# EAGLE design moduleDHT22 (EAGLE 6.5.0)
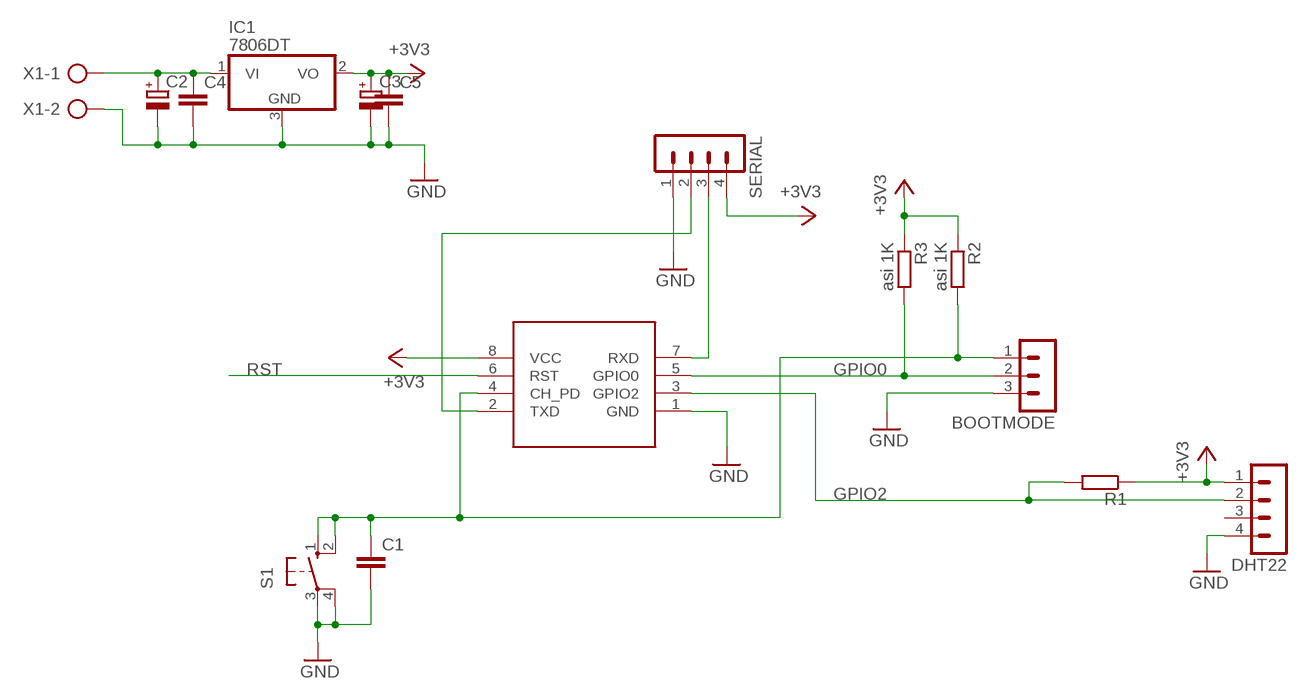
[diagram p0: schematic, sheet 1]

## Parts
BOOTMODE  MA03-1  [MA03-1]
C1  C-EUC0603  [C0603]
C2  CPOL-EU153CLV-0505  [153CLV-0505]
C3  CPOL-EU153CLV-0505  [153CLV-0505]
C4  C-EUC0603  [C0603]
C5  C-EUC0603  [C0603]
DHT22  MA04-1  [MA04-1]
IC1  7806DT  [TO252]
R1  R-EU_R0603  [R0603]
R2  asi 1K  R-EU_R0603  [R0603]
R3  asi 1K  R-EU_R0603  [R0603]
S1  10-XX  [B3F-10XX]
SERIAL  MA04-1  [MA04-1]
U$1  ESP8266-01  [ESP8266-01]
X1  AK300/2  [AK300/2]

## Nets
+3V3: C3.+ C5.1 DHT22.1 IC1.2(VO) R1.1 R2.1 R3.1 SERIAL.4 U$1.8(VCC)
GND: BOOTMODE.3 C1.2 C2.- C3.- C4.2 C5.2 DHT22.4 IC1.3(GND) S1.3(P) S1.4(P1) SERIAL.1 U$1.1(GND) X1.2
GPIO0: BOOTMODE.2 R3.2 U$1.5(GPIO0)
GPIO2: DHT22.2 R1.2 U$1.3(GPIO2)
N$1: C2.+ C4.1 IC1.1(VI) X1.1
N$2: SERIAL.2 U$1.2(TXD)
N$3: SERIAL.3 U$1.7(RXD)
N$5: BOOTMODE.1 C1.1 R2.2 S1.1(S) S1.2(S1) U$1.4(CH_PD)
RST: U$1.6(RST)
Unconnected: DHT22.3

## Library data of the parts
BOOTMODE = con-lstb:MA03-1: PIN HEADER; OC_FARNELL: unknown; OC_NEWARK: unknown
C1 C4 C5 = rcl:C-EU: CAPACITOR, European symbol
C2 C3 = rcl:CPOL-EU: POLARIZED CAPACITOR, European symbol
DHT22 SERIAL = con-lstb:MA04-1: PIN HEADER; OC_FARNELL: unknown; OC_NEWARK: unknown
IC1 = linear:78*: Positive VOLTAGE REGULATOR Source: http://cache.national.com/ds/LM/LM78L05.pdf http://www.fairchildsemi.com/ds/LM/LM7805.pdf
R1-R3 = rcl:R-EU_: RESISTOR, European symbol
S1 = switch-omron:10-XX: OMRON SWITCH; MPN: B3F-1000; OC_FARNELL: 176432; OC_NEWARK: 36M3542
U$1 = ESP8266:ESP8266-01
X1 = con-ptr500:AK300/2: CONNECTOR; OC_FARNELL: unknown; OC_NEWARK: unknown

## Board
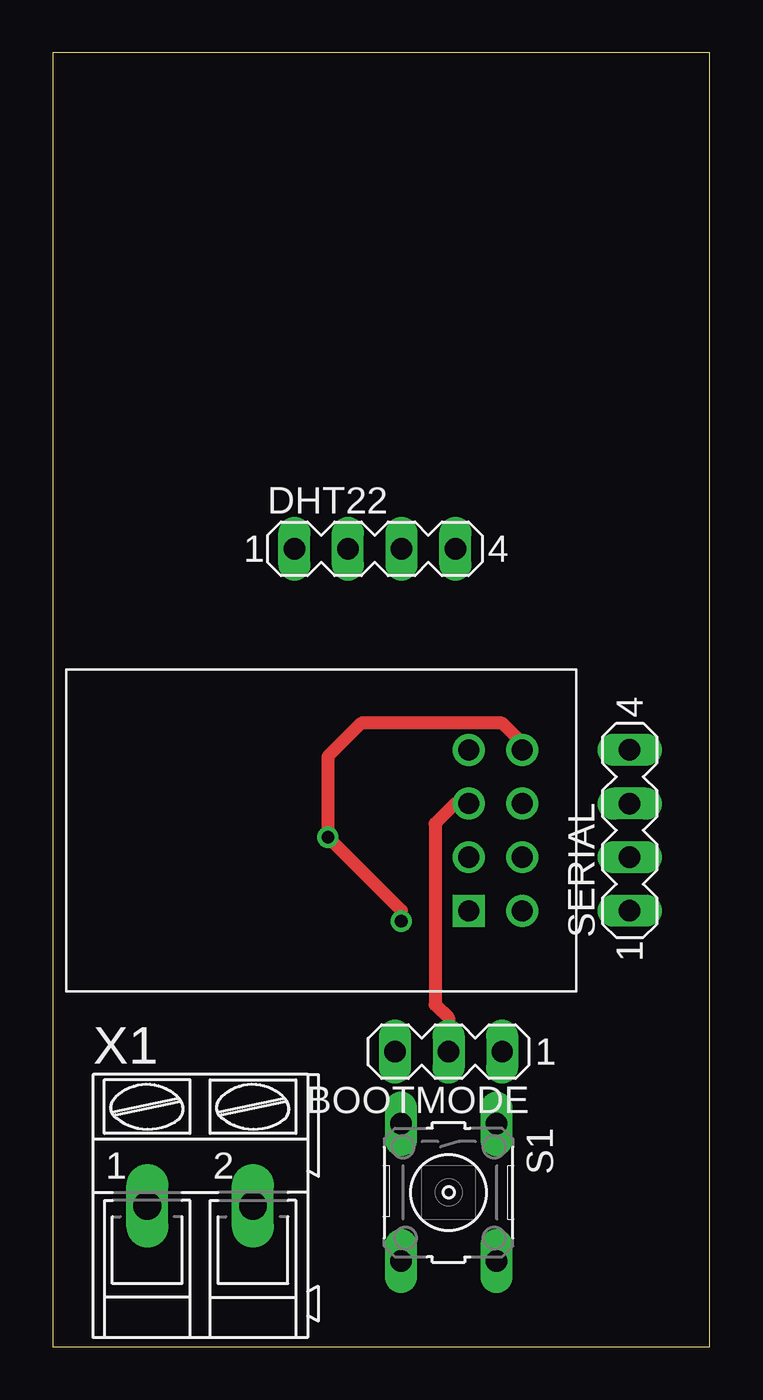
[diagram p1: board, top side]
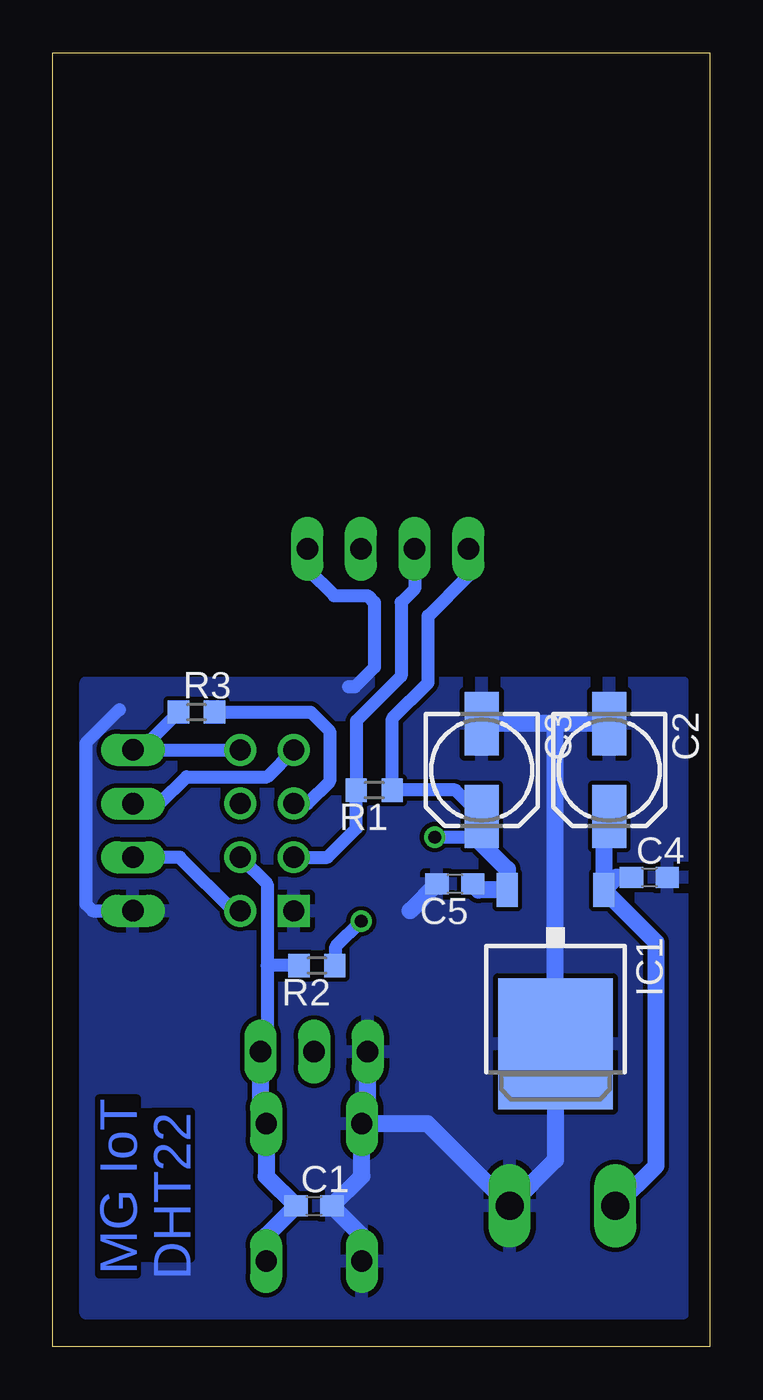
[diagram p2: board, bottom side, seen from below]

Size 31.09 x 61.27 mm. Coordinates in mm from the lower left corner, seen from the top.
Outline: 0,0 31.09,0 31.09,61.27 0,61.27 0,0
Copper layers (1*16): Top 0.035mm / dielectric 1.5mm / Bottom 0.035mm
Design rules "default": minimum track width 10mil, minimum drill 24mil, track to track 8mil, track to pad 8mil, pad to pad 8mil, via to via 8mil, smd to smd 8mil, copper to edge 40mil, drill to drill 8mil, minimum pad ring 10mil, minimum via ring 8mil, stop-mask expansion 4mil, vias tented up to drill 0mil, thermal gap 10mil

### Footprints (pad centres in the part's own frame; a part is rotated, then mirrored left to right if it is on the bottom)
MA03-1 = drill 1.016 long: 1 -2.54,0; 2 0,0; 3 2.54,0
C0603 = smd 1.1 x 1: 1 -0.85,0; 2 0.85,0
153CLV-0505 = smd 3 x 1.6: + 2.2,0; - -2.2,0
MA04-1 = drill 1.016 long: 1 -3.81,0; 2 -1.27,0; 3 1.27,0; 4 3.81,0
TO252 = smd 1 x 1.6: 1 -2.28,-4.8; 2 2.28,-4.8 | smd 5.4 x 6.2: 3 0,2.5
R0603 = smd 1 x 1.1: 1 -0.85,0; 2 0.85,0
B3F-10XX = drill 1.016 long: 1 -3.251,2.261; 2 3.251,2.261; 3 -3.251,-2.261; 4 3.251,-2.261
ESP8266-01 = drill 1 square: 1 -1.27,-3.81 | drill 1: 2 1.27,-3.81; 3 -1.27,-1.27; 4 1.27,-1.27; 5 -1.27,1.27; 6 1.27,1.27; 7 -1.27,3.81; 8 1.27,3.81
AK300/2 = drill 1.321 long: 1 -2.515,0; 2 2.489,0

### Placement (x,y rotation side)
BOOTMODE  18.73,13.97 180 top
C1  18.73,6.67 0 bottom
C2  4.76,27.3 270 bottom
C3  10.8,27.3 270 bottom
C4  2.86,22.23 0 bottom
C5  12.06,21.91 180 bottom
DHT22  15.24,37.78 0 top
IC1  7.3,16.83 180 bottom
R1  15.88,26.35 180 bottom
R2  18.59,18.05 180 bottom
R3  24.3,30.05 0 bottom
S1  18.73,7.3 270 top
SERIAL  27.3,24.45 90 top
U$1  20.95,24.45 0 top
X1  6.98,6.67 0 top

### Tracks (layer width: path | path; a pad name or v marks a point on that pad's centre or on a via)
+3V3  (via drill 0.6, 0.6 pad 0.81)
  Top 0.61: U$1.8 22.23,28.58 21.27,29.53 14.6,29.53 13.02,27.94 v13.02,24.13 16.49,20.65 v16.49,20.15
  Bottom 0.61: U$1.8 SERIAL.4 26.94,28.26 R3.1 | C3.+ 12.04,26.35 R1.1 15.02,29.74 13.34,31.43 13.34,34.61 11.43,36.51 DHT22.1 | v13.02,24.13 10.8,24.13 | R2.1 17.7,18.05 17.7,18.95 v16.49,20.15
  Bottom 0.813: 9.62,21.59 IC1.2 | IC1.2 10.94,21.63 C5.1 | C3.+ 10.8,24.13 10.8,23.81 9.58,22.6 IC1.2
GND
  Bottom 0.61: 28.26,20.64 SERIAL.1 29.21,20.64 29.53,20.95 29.53,28.58 27.94,30.16 | S1.3 16.19,10.2 | DHT22.4 19.05,36.83 17.78,35.56 16.19,35.56 15.88,35.24 15.88,32.17 16.8,31.25 17.09,31.25
  Bottom 0.813: C2.- 7.3,29.51 | 7.3,29.51 C3.- | 7.3,29.51 IC1.3 7.3,8.84 X1.2 13.36,10.55 S1.3 16.47,8.08 C1.2 16.47,5.26 S1.4 | 16.19,10.2 BOOTMODE.3 | C5.2 14.19,20.64
  pour Bottom: 1.27,1.59 29.53,1.59 29.53,31.43 1.27,31.43
GPIO0
  Top 0.61: U$1.5 19.05,25.72 18.1,24.76 18.1,16.19 18.73,15.56 BOOTMODE.2
  Bottom 0.61: R3.2 18.9,30.05 17.99,29.15 17.99,26.77 19.05,25.72 U$1.5
GPIO2
  Bottom 0.61: U$1.3 18.1,23.18 16.73,24.55 R1.2 16.73,29.63 14.6,31.75 14.6,35.24 13.97,35.88 DHT22.2
N$1
  Bottom 0.813: IC1.1 2.54,19.15 2.54,8.57 4.45,6.67 X1.1 4.47,6.64 | C4.1 4.43,22.23 IC1.1 | C2.+ 5.02,24.84 IC1.1
N$2
  Bottom 0.61: U$1.2 22.54,20.64 25.08,23.18 SERIAL.2
N$3
  Bottom 0.61: SERIAL.3 26.04,25.72 24.77,26.99 20.95,26.99 U$1.7
N$5
  Bottom 0.61: U$1.4 20.95,21.91 20.95,18.05 | 20.95,18.05 20.95,14.29 BOOTMODE.1 | 21.27,10.2 S1.1 | R2.2 20.95,18.05
  Bottom 0.813: BOOTMODE.1 21.27,10.2 | S1.1 20.99,8.08 C1.1 20.99,5.26 S1.2

### Text on the board
Bottom: MG IoT | DHT22
100bmp: sensor | made by Vojta | IoT | VCC | DATA | NC | GND | type: DHT22 | iot.installfest.cz | VCC | RXD | TXD | GND | GND | GPIO0 | CH_PD | UART | 5-12V | + | - | Reset SW